# EAGLE design 708_universal_3pin (EAGLE 7.6.0)
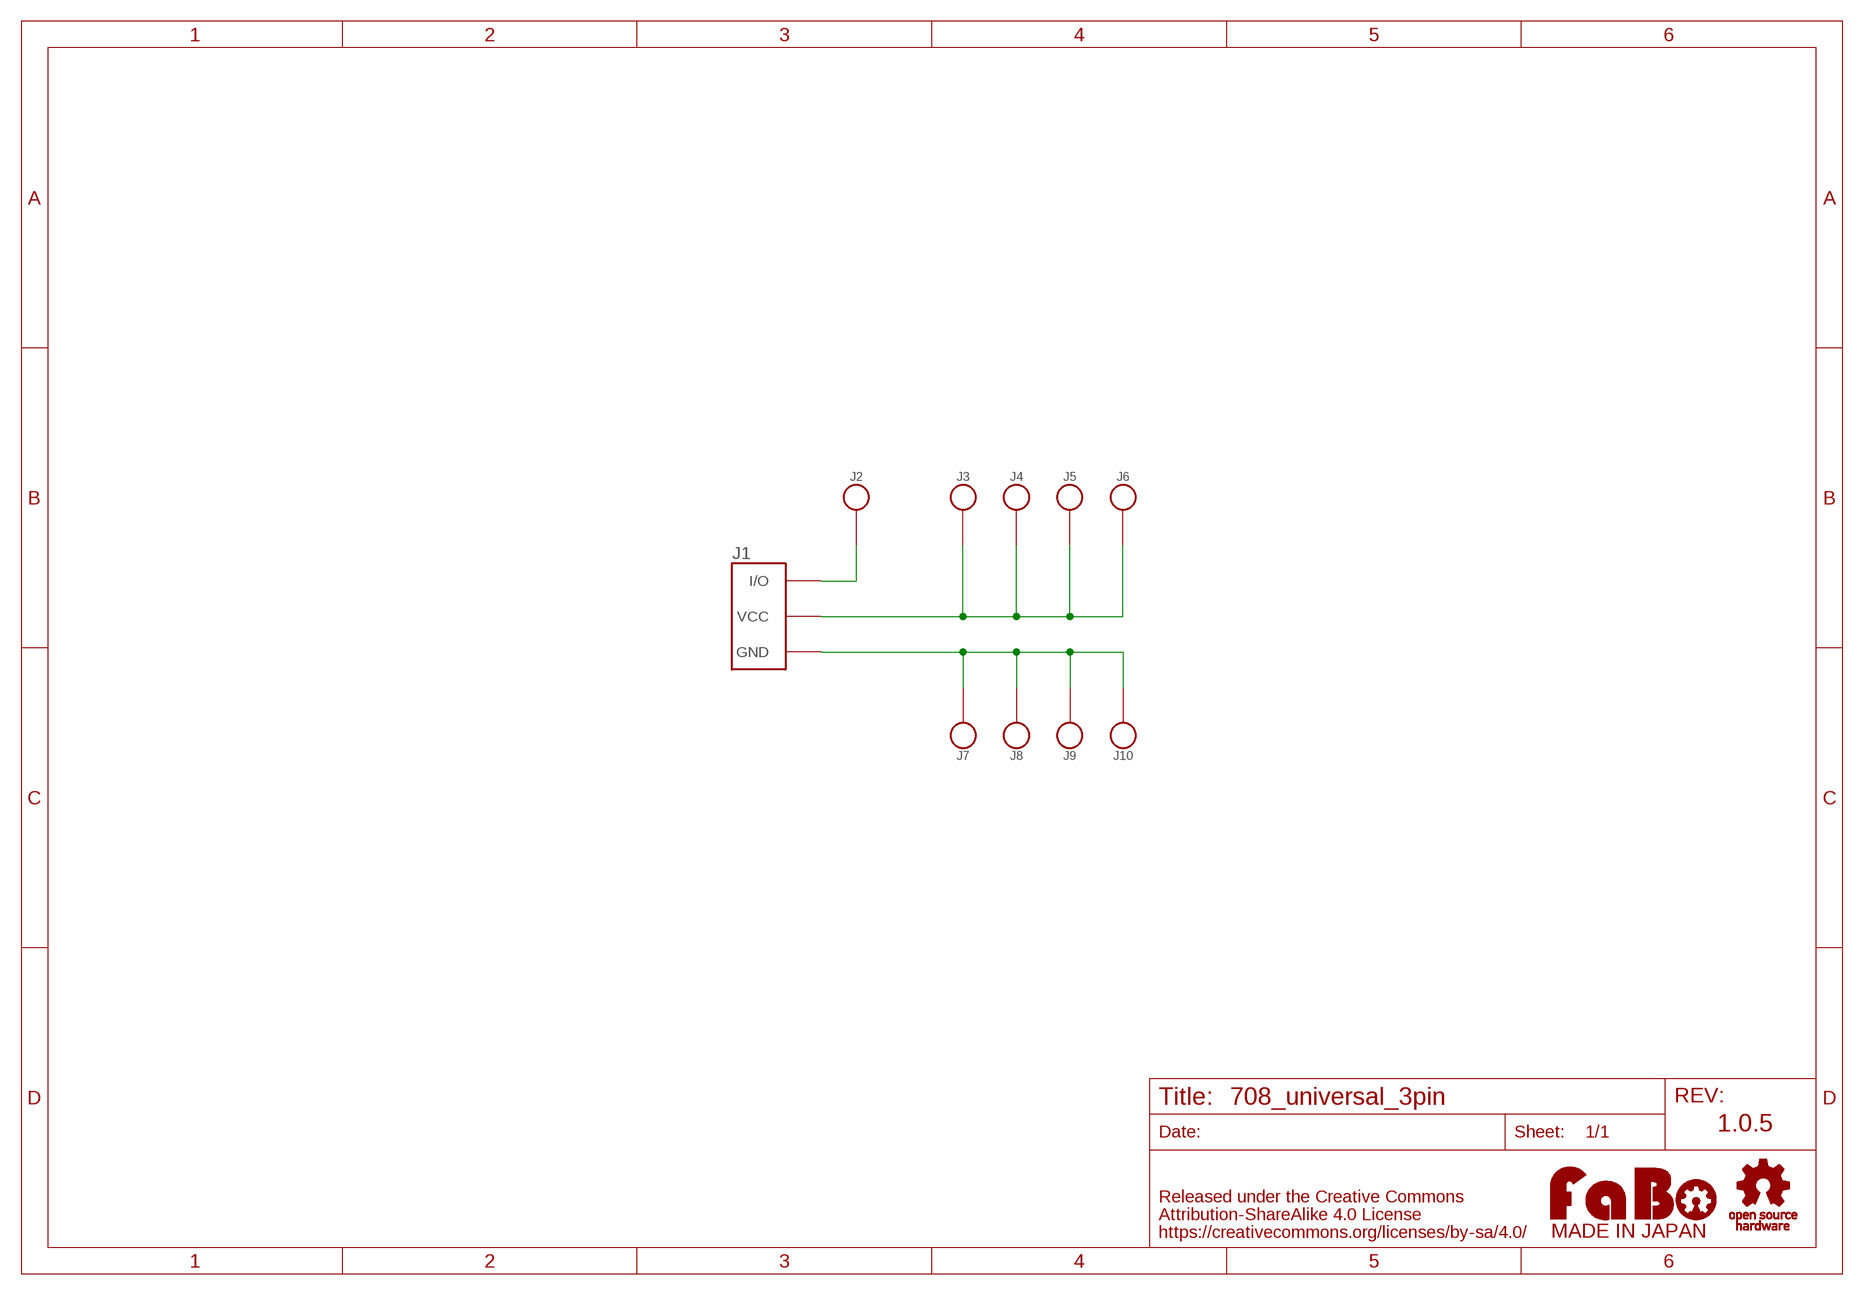
[diagram p0: schematic, sheet 1]

## Parts
J1  FABO_BRICK_3PIN-UNIVERSAL  [FABO_BRICK_3PIN_UNIVERSAL]
J2  PIN_HEADER_1X1_NOLABEL  [PIN_1X1_NOLABEL]
J3  PIN_HEADER_1X1_NOLABEL  [PIN_1X1_NOLABEL]
J4  PIN_HEADER_1X1_NOLABEL  [PIN_1X1_NOLABEL]
J5  PIN_HEADER_1X1_NOLABEL  [PIN_1X1_NOLABEL]
J6  PIN_HEADER_1X1_NOLABEL  [PIN_1X1_NOLABEL]
J7  PIN_HEADER_1X1_NOLABEL  [PIN_1X1_NOLABEL]
J8  PIN_HEADER_1X1_NOLABEL  [PIN_1X1_NOLABEL]
J9  PIN_HEADER_1X1_NOLABEL  [PIN_1X1_NOLABEL]
J10  PIN_HEADER_1X1_NOLABEL  [PIN_1X1_NOLABEL]
U$1  LOGO_OSHW-M_BOTTOM  [LOGO_OSHW_M_BOTTOM]
U$3  LOGO_FABO-M_BOTTOM  [LOGO_FABO_MS_BOTTOM]

## Nets
GND: J1.GND J7.1 J8.1 J9.1 J10.1
IO: J1.I/O J2.1
VCC: J1.VCC J3.1 J4.1 J5.1 J6.1

## Notes on the sheet
- 1.0.5

## Library data of the parts
J1 = FaBo-Template:FABO_BRICK_3PIN: FaBo Brick 3pin
J2-J10 = FaBo-PIN:PIN_HEADER_1X1_NOLABEL
U$1 = FaBo-etc:LOGO_OSHW
U$3 = FaBo-etc:LOGO_FABO

## Board
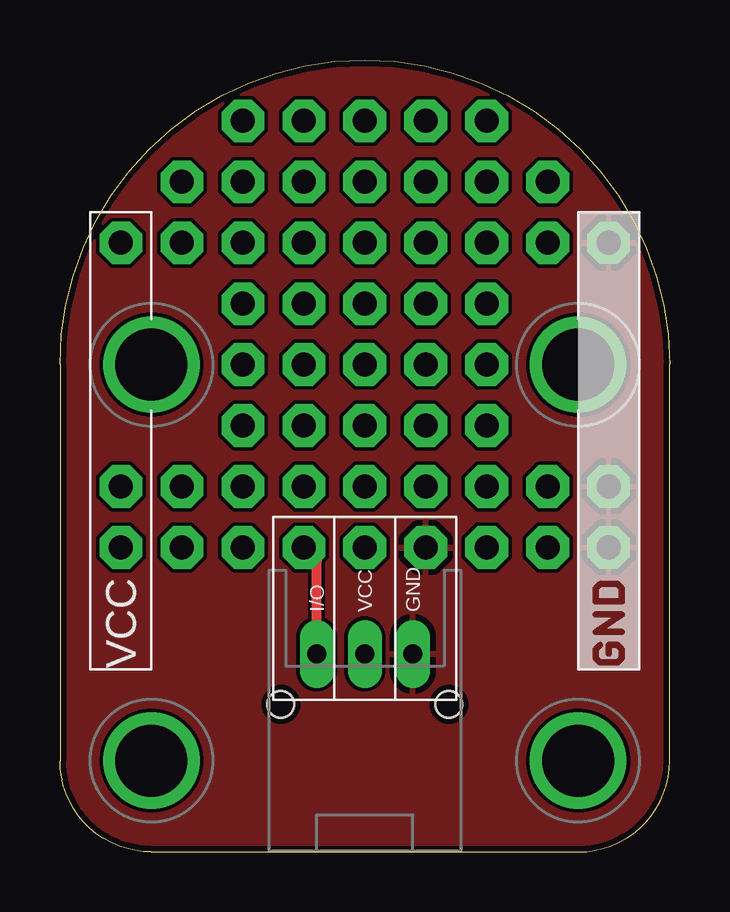
[diagram p1: board, top side]
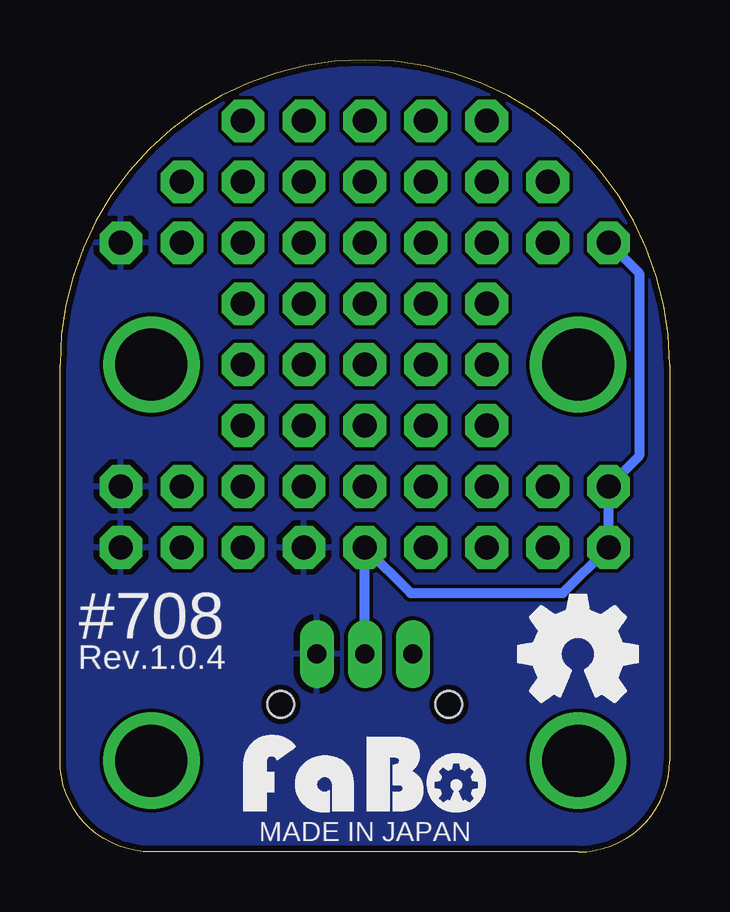
[diagram p2: board, bottom side, seen from below]

Size 25.4 x 33.02 mm. Coordinates in mm from the lower left corner, seen from the top.
Copper layers (1*16): Top 0.035mm / dielectric 1.5mm / Bottom 0.035mm
Design rules "SeeedStudio_2layer_DRU_no_angle_20140221": minimum track width 6mil, minimum drill 12mil, track to track 6mil, track to pad 6mil, pad to pad 6mil, via to via 6mil, smd to smd 0mil, copper to edge 10mil, drill to drill 10mil, minimum pad ring 10mil, minimum via ring 6mil, stop-mask expansion 2mil, vias tented up to drill 100mil, thermal gap 10mil

### Footprints (pad centres in the part's own frame; a part is rotated, then mirrored left to right if it is on the bottom)
FABO_BRICK_3PIN_UNIVERSAL = drill 0.8 pad 1.422 long: GND 2,-8.255; I/O -2,-8.255; VCC 0,-8.255 | drill 1 pad 1.778 octagon: P$1 -2.54,-1.27; P$2 0,-1.27; P$3 2.54,-1.27; P$4 5.08,-3.81; P$9 7.62,-3.81; P$10 -5.08,-3.81; P$11 -7.62,-3.81; P$15 -7.62,-1.27; P$16 -5.08,-1.27; P$20 5.08,-1.27; P$21 7.62,-1.27; P$23 5.08,1.27; P$24 2.54,1.27; P$25 0,1.27; P$26 -2.54,1.27; P$27 -5.08,1.27; P$28 -5.08,3.81; P$29 -2.54,3.81; P$30 0,3.81; P$31 2.54,3.81; P$32 5.08,3.81; P$33 5.08,6.35; P$34 2.54,6.35; P$35 0,6.35; P$36 -2.54,6.35; P$37 -5.08,6.35; P$38 -5.08,8.89; P$39 -7.62,8.89; P$41 -2.54,8.89; P$42 0,8.89; P$43 2.54,8.89; P$44 5.08,8.89; P$45 7.62,8.89; P$47 7.62,11.43; P$48 5.08,11.43; P$49 2.54,11.43; P$50 0,11.43; P$51 -2.54,11.43; P$52 -5.08,11.43; P$53 -7.62,11.43; P$54 -2.54,13.97; P$55 -5.08,13.97; P$56 0,13.97; P$57 2.54,13.97; P$58 5.08,13.97 | drill 3 pad 3.81: P$5 -8.89,3.81; P$6 8.89,3.81; P$7 -8.89,-12.7; P$8 8.89,-12.7 | hole 1.1: -3.5,-10.355; 3.5,-10.355
PIN_1X1_NOLABEL = drill 1 pad 1.778 octagon: 1 0,0

### Placement (x,y rotation side)
J1  12.7,16.51 0 top
J2  10.16,12.7 0 top
J3  12.7,12.7 0 top
J4  2.54,12.7 0 top
J5  2.54,15.24 0 top
J6  2.54,25.4 0 top
J7  15.24,12.7 0 top
J8  22.86,12.7 0 top
J9  22.86,15.24 0 top
J10  22.86,25.4 0 top
U$1  3.81,8.26 0 top
U$3  12.7,1.27 0 top
U$4  [LOGO_SILK_GND]  24.13,7.62 90 top

### Tracks (layer width: path | path; a pad name or v marks a point on that pad's centre or on a via)
GND
  pour Bottom: 0,0 25.4,0 25.4,33.02 0,33.02
  pour Top: 0,0 25.4,0 25.4,33.02 0,33.02
IO
  Top 0.406: J1.I/O 10.7,12.16 J2.1
VCC
  Bottom 0.406: J1.VCC J3.1 10.79,10.79 4.45,10.79 J4.1 J5.1 1.27,16.51 1.27,24.13 J6.1

### Text on the board
tPlace: VCC
bPlace: #708 | Rev.1.0.4 | MADE IN JAPAN